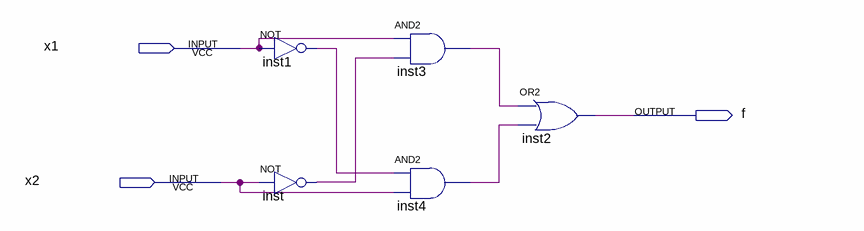
[diagram p0: schematic sheet]
// Quartus schematic tuto.bdf as structural Verilog: 5 symbols, 3 pins
module tuto (
  input  x1,
  input  x2,
  output f
);

  wire inst1_out, inst3_out, inst4_out, inst_out;

  not inst1 (inst1_out, x1);
  not inst (inst_out, x2);
  and inst3 (inst3_out, x1, inst_out);
  and inst4 (inst4_out, inst1_out, x2);
  or inst2 (f, inst3_out, inst4_out);
endmodule
